# EAGLE design momav_imu (EAGLE 9.6.1)
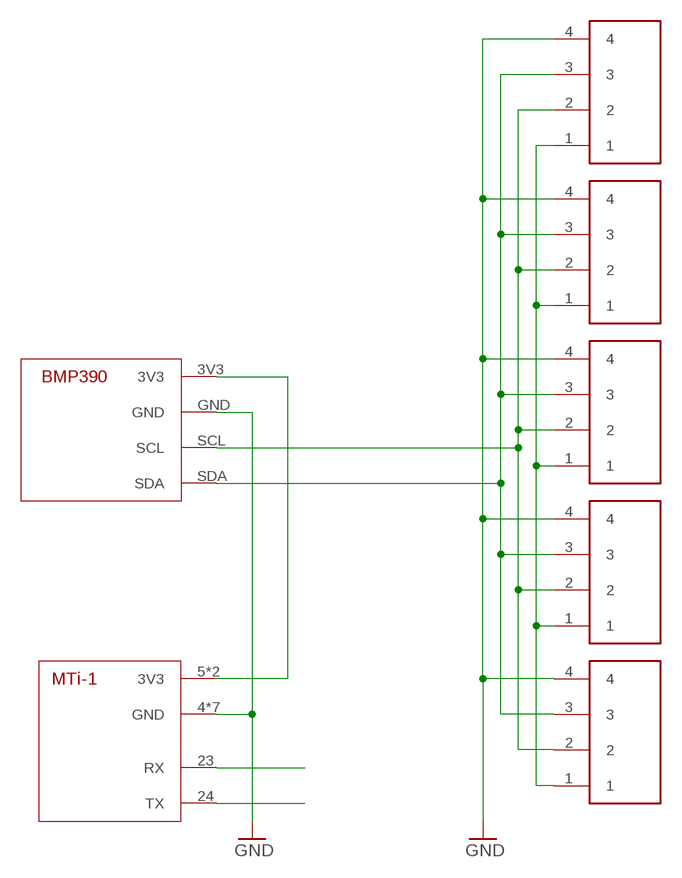
[diagram p0: schematic, sheet 1]

## Parts
U$1  JST_ZH_4P  [JST_ZH_4P]
U$2  JST_ZH_4P  [JST_ZH_4P]
U$3  JST_ZH_4P  [JST_ZH_4P]
U$4  JST_ZH_4P  [JST_ZH_4P]
U$5  JST_ZH_4P  [JST_ZH_4P]
U$6  XSENS_MTI_1  [XSENS_MTI_1]
U$7  BMP390  [BMP390]

## Nets
3V3: U$6.5(3V3) U$6.7(3V3) U$7.3V3
5V: U$1.1 U$2.1 U$3.1 U$4.1 U$5.1
GND: U$1.4 U$2.4 U$3.4 U$4.4 U$5.4 U$6.4(GND) U$6.8(GND) U$6.13(GND) U$6.14(GND) U$6.15(GND) U$6.22(GND) U$6.25(GND) U$7.GND
RX: U$6.23(RX)
SCL: U$1.2 U$2.2 U$3.2 U$4.2 U$5.2 U$7.SCL
SDA: U$1.3 U$2.3 U$3.3 U$4.3 U$5.3 U$7.SDA
TX: U$6.24(TX)

## Library data of the parts
U$1-U$5 = _custom:JST_ZH_4P
U$6 = _custom:XSENS_MTI_1
U$7 = _custom:BMP390

## Board
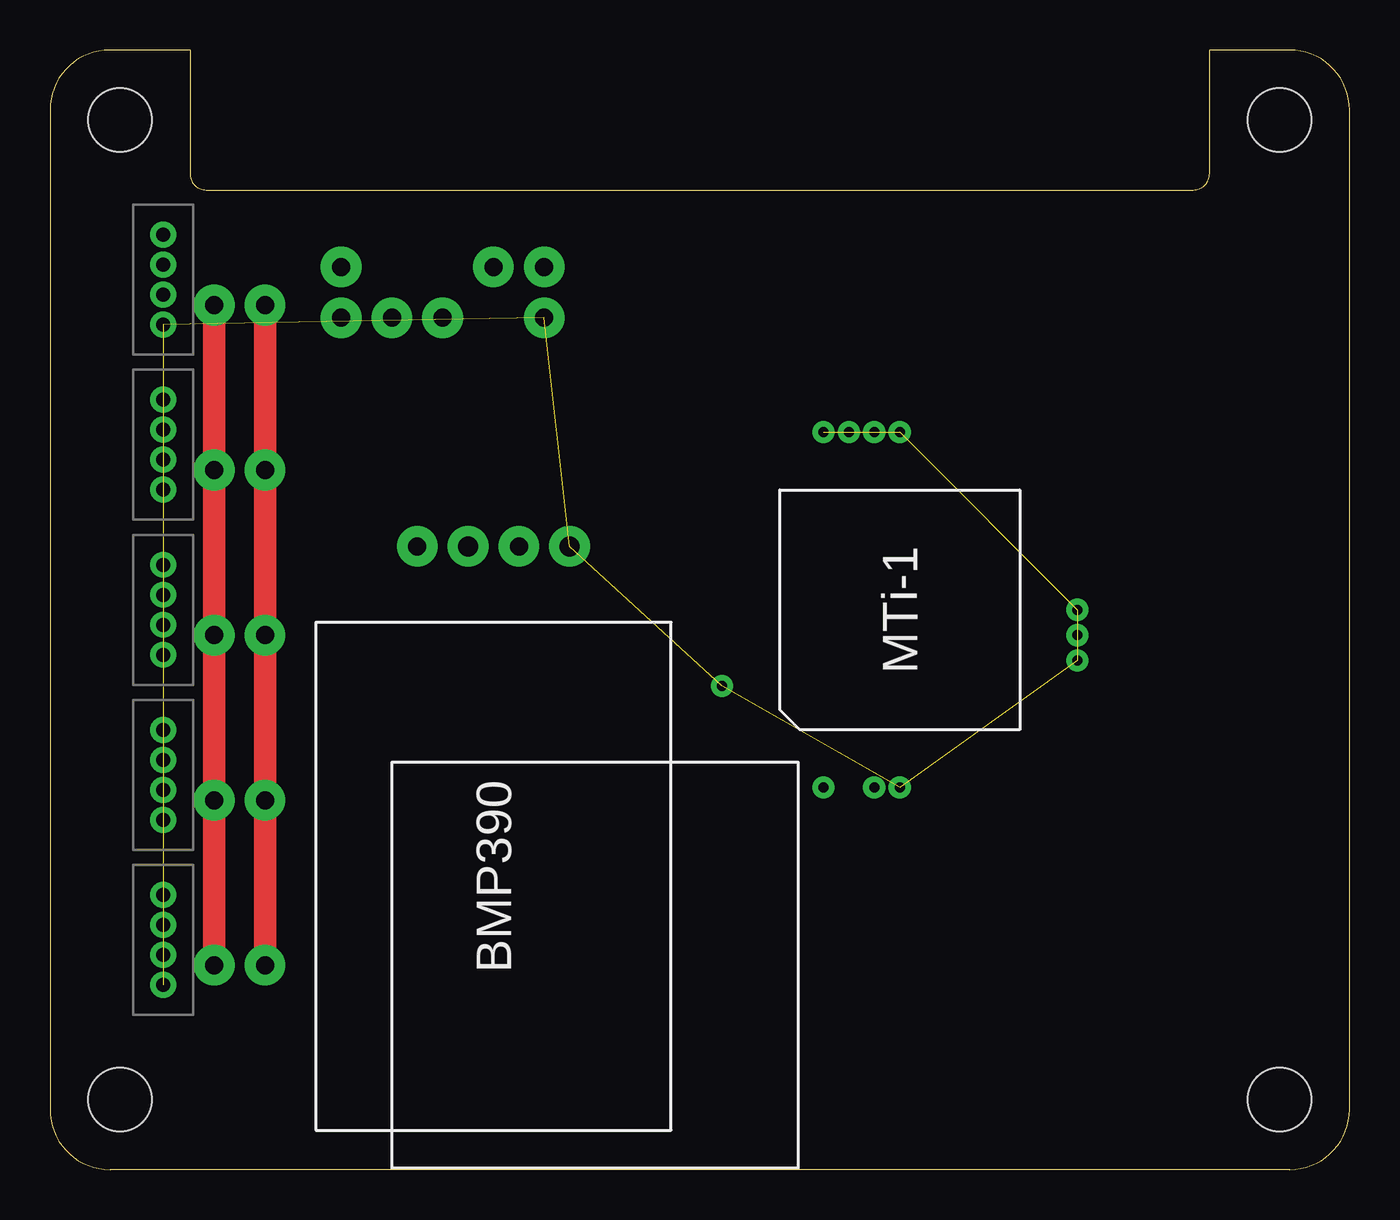
[diagram p1: board, top side]
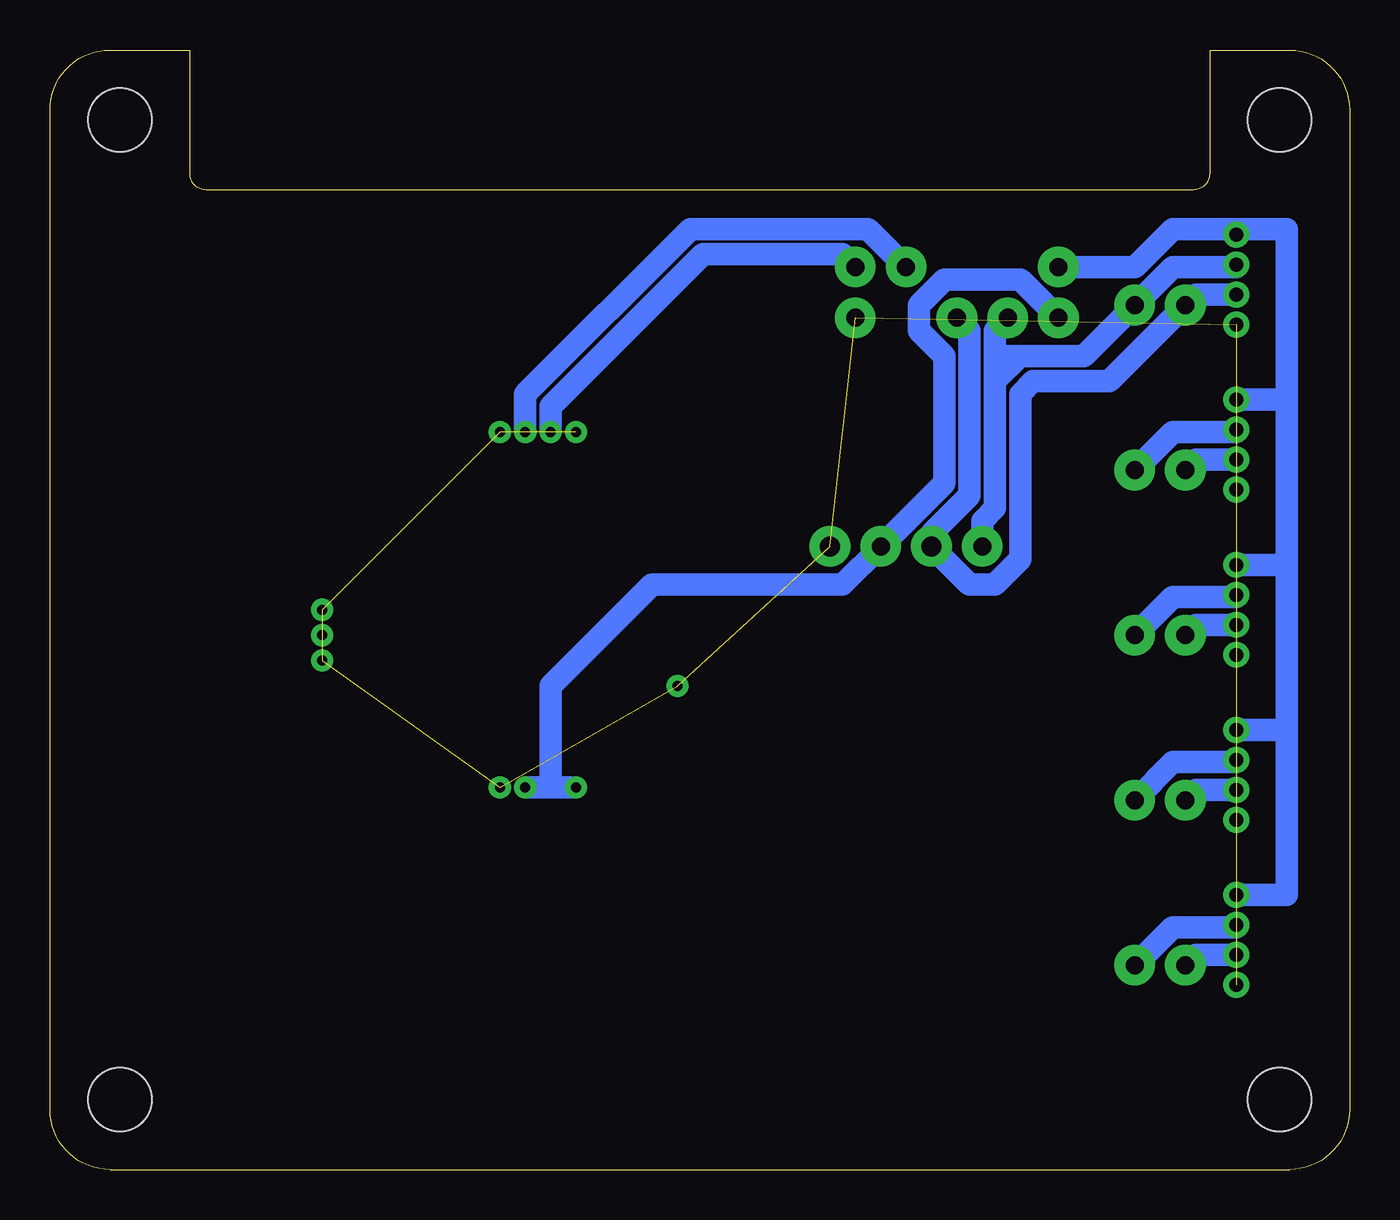
[diagram p2: board, bottom side, seen from below]

Size 65 x 56 mm. Coordinates in mm from the lower left corner, seen from the top.
Outline: 0,53 0,3 arc90 3,0 62,0 arc90 65,3 65,53 arc90 62,56 58,56 58,49.81 arc-90 57.19,49 7.81,49 arc-90 7,49.81 7,56 3,56 arc90 0,53
Copper layers (1*16): Top 0.035mm / dielectric 1.5mm / Bottom 0.035mm
Design rules "default": minimum track width 6mil, minimum drill 0.35mm, track to track 6mil, track to pad 6mil, pad to pad 6mil, via to via 6mil, smd to smd 6mil, copper to edge 40mil, drill to drill 6mil, minimum pad ring 10mil, minimum via ring 8mil, stop-mask expansion 4mil, vias tented up to drill 0mil, thermal gap 10mil
Holes 3.17 mm at 3.5,52.5 61.5,52.5 61.5,3.5 3.5,3.5

### Footprints (pad centres in the part's own frame; a part is rotated, then mirrored left to right if it is on the bottom)
JST_ZH_4P = drill 0.7 pad 1.295: 1 -2.25,0; 2 -0.75,0; 3 0.75,0; 4 2.25,0
XSENS_MTI_1 = drill 0.5 pad 1.118: 4 -3.81,8.89; 5 -8.89,3.81; 7 -8.89,1.27; 8 -8.89,0; 13 -2.54,-8.89; 14 -1.27,-8.89; 15 0,-8.89; 22 8.89,0; 23 8.89,1.27; 24 8.89,2.54; 25 8.89,3.81
BMP390 = drill 0.9 pad 2.032: 3V3 16.51,-1.27; SCL 16.51,3.81 | drill 1 pad 2.032: GND 16.51,-3.81; SDA 16.51,1.27

### Placement (x,y rotation side)
U$1  5.67,44.51 270 top
U$2  5.67,36.26 270 top
U$3  5.67,28 270 top
U$4  5.67,19.74 270 top
U$5  5.67,11.49 270 top
U$6  42.5,28 90 top
U$7  22.18,14.66 90 top

### Tracks (layer width: path | path; a pad name or v marks a point on that pad's centre or on a via)
3V3  (via drill 0.9 pad 2.03)
  Bottom 1.118: U$6.7 39.96,19.11 | 39.96,19.11 U$6.5 | v14.56,42.61 16.46,44.51 20.27,44.51 21.55,43.24 21.55,41.97 20.27,40.7 20.27,34.35 U$7.3V3 25.36,29.27 34.88,29.27 39.96,24.19 39.96,19.11
5V  (via drill 0.9 pad 2.03)
  Bottom 1.118: 5.38,47.05 U$1.1 5.96,47.05 | 5.38,47.05 3.13,47.05 3.13,38.51 | 3.13,38.51 3.13,30.25 | 3.13,30.25 3.13,22 | 3.13,22 3.13,13.74 U$5.1 | U$4.1 3.13,22 | U$3.1 3.13,30.25 | U$2.1 3.13,38.51 | 5.96,47.05 5.38,47.05 | v14.56,45.14 10.75,45.14 8.84,47.05 5.96,47.05
GND  (via drill 0.9 pad 2.03)  (13 unrouted)
  other vias: 24.72,42.61
RX  (via drill 0.9 pad 2.03)
  Bottom 1.118: U$6.23 41.23,38.8 32.98,47.05 24.09,47.05 v22.18,45.14
SCL  (via drill 0.9 pad 2.03)
  Top 1.118: v10.75,10.22 v10.75,18.48 v10.75,26.73 v10.75,34.98 v10.75,43.24
  Bottom 1.118: v10.75,34.98 8.84,36.89 5.67,36.89 U$2.2 | U$1.2 5.67,45.14 8.84,45.14 v10.75,43.24 13.29,40.7 16.46,40.7 | v10.75,26.73 8.84,28.64 5.67,28.64 U$3.2 | U$4.2 5.67,20.38 8.84,20.38 v10.75,18.48 | U$5.2 5.67,12.12 8.84,12.12 v10.75,10.22 | U$7.SCL 18.37,32.45 17.73,33.08 17.73,39.43 | 17.73,39.43 17.73,40.7 | 17.73,40.7 17.73,41.97 v17.1,42.61 | 17.73,40.7 16.46,40.7 | 16.46,40.7 17.73,39.43
SDA  (via drill 0.9 pad 2.03)
  Top 1.118: v8.21,10.22 v8.21,18.48 v8.21,26.73 v8.21,34.98 v8.21,43.24
  Bottom 1.118: U$2.3 7.69,35.51 v8.21,34.98 | U$1.3 7.69,43.76 v8.21,43.24 12.02,39.43 15.83,39.43 16.46,38.8 16.46,30.54 17.73,29.27 19,29.27 U$7.SDA 20.91,31.81 19,33.72 19,41.97 v19.64,42.61 | U$3.3 7.69,27.25 v8.21,26.73 | U$4.3 7.69,18.99 v8.21,18.48 | U$5.3 7.69,10.74 v8.21,10.22
TX  (via drill 0.9 pad 2.03)
  Bottom 1.118: U$6.24 39.96,38.16 32.34,45.78 25.36,45.78 v24.72,45.14